# EAGLE design WIFI-RF433 (EAGLE 6.1)

## Sheet 1 of 3
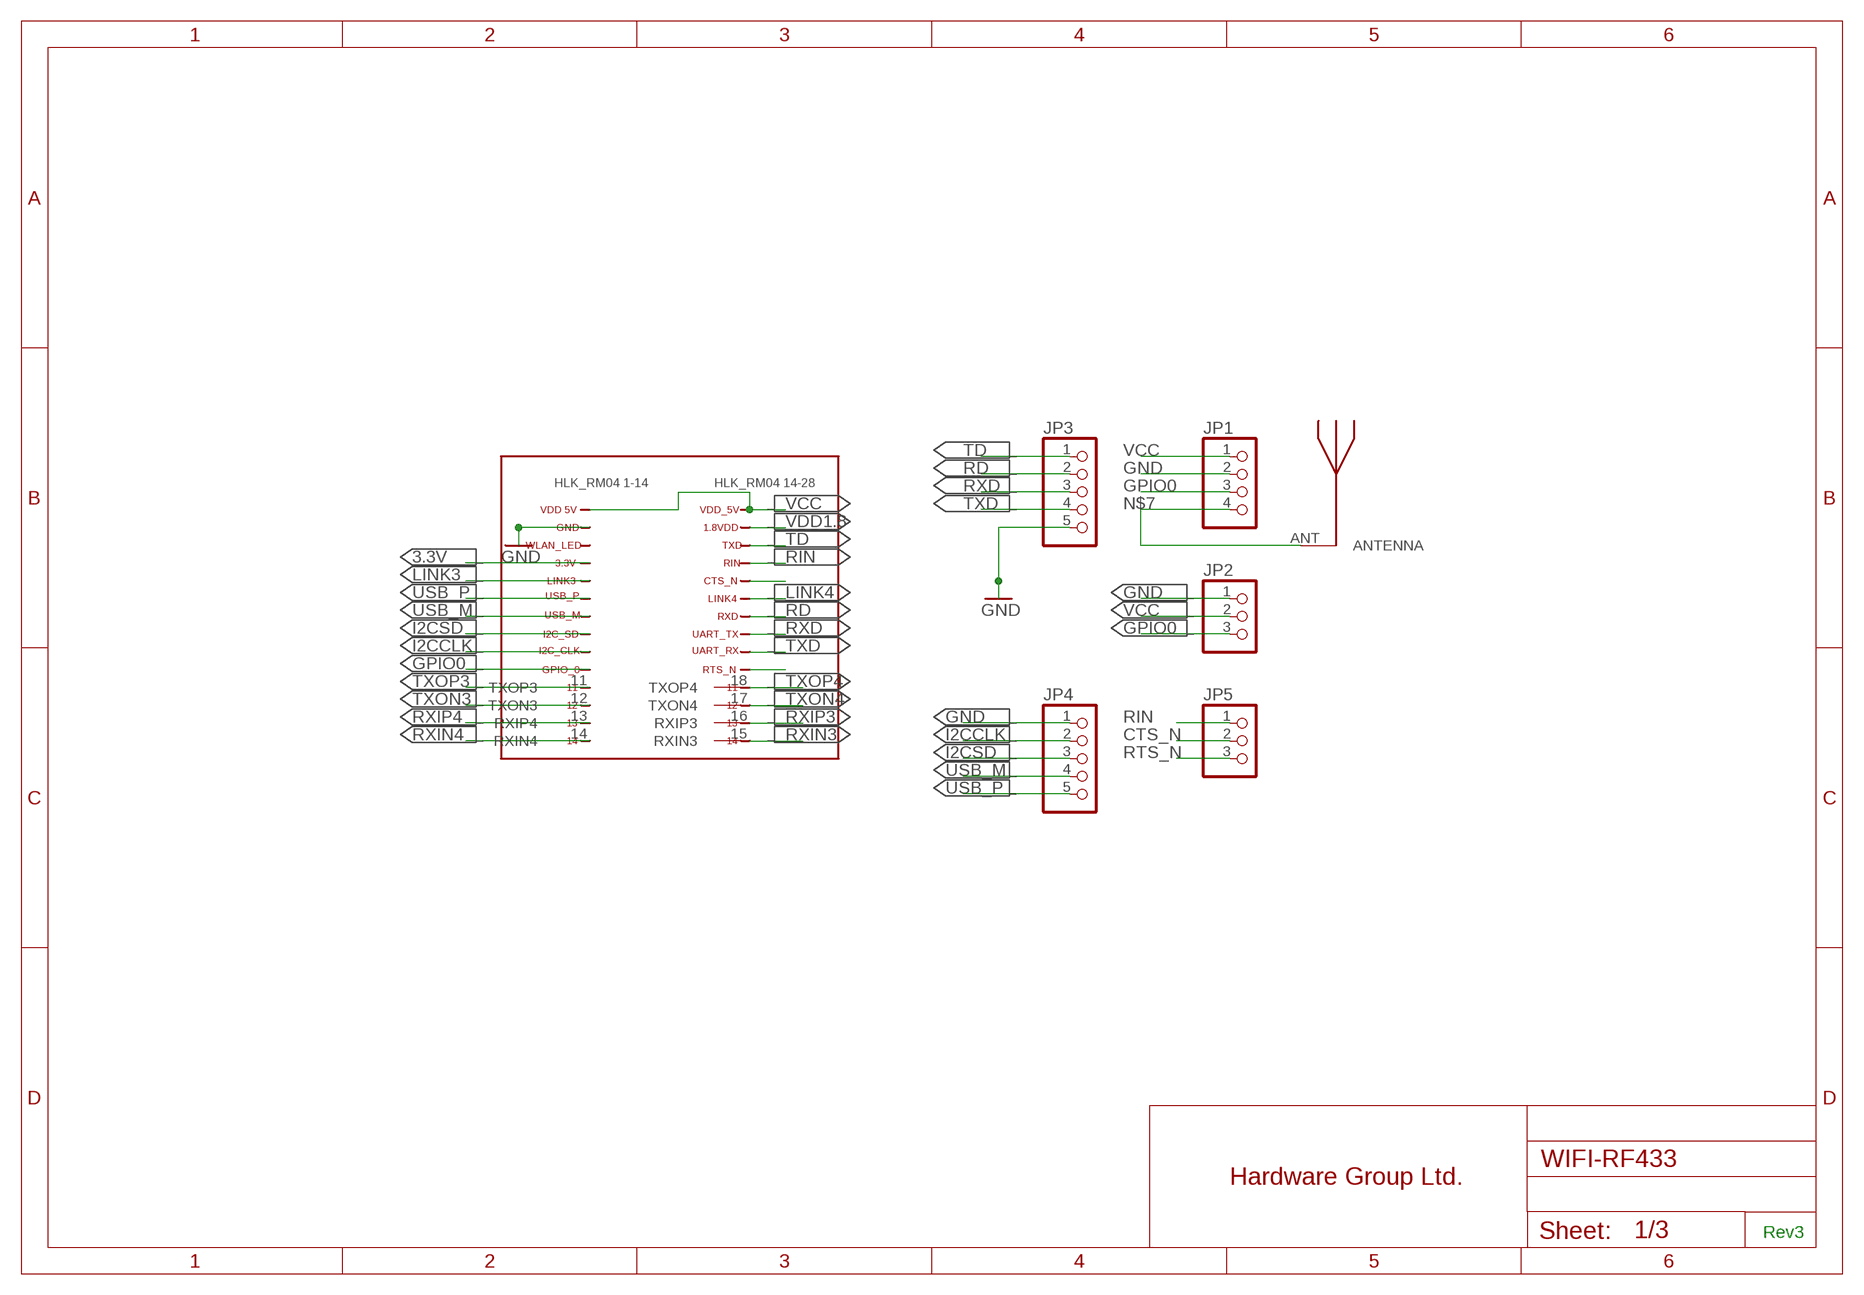
[diagram p0: schematic, sheet 1]

### Parts
JP1  PINHD-1X4  [1X04]
JP2  PINHD-1X3  [1X03]
JP3  PINHD-1X5  [1X05]
JP4  PINHD-1X5  [1X05]
JP5  PINHD-1X3  [1X03]
U$4  433MHZ  [433MHZ]
U$8  1X10  [1X10]

### Nets
3.3V: U$8.4(3.3VDD)
CTS_N: JP5.2 U$8.24(CTS_N)
GND: JP1.2 JP2.1 JP3.5 JP4.1 U$8.2(GND) ; also sheet 2,3
GPIO0: JP1.3 JP2.3 U$8.10(GPIO_0)
I2CCLK: JP4.2 U$8.9(I2C_CLK)
I2CSD: JP4.3 U$8.8(I2C_SD)
LINK3: U$8.5(LINK3) ; also sheet 2
LINK4: U$8.23(LINK4) ; also sheet 2
N$7: JP1.4 U$4.ANT(ANTENNA)
RD: JP3.2 U$8.22(RXD)
RIN: JP5.1 U$8.25(RIN)
RTS_N: JP5.3 U$8.19(RTS_N)
RXD: JP3.3 U$8.21(UART_TX)
RXIN3: U$8.15(RXIN3) ; also sheet 2
RXIN4: U$8.14(RXIN4) ; also sheet 2
RXIP3: U$8.16(RXIP3) ; also sheet 2
RXIP4: U$8.13(RXIP4) ; also sheet 2
TD: JP3.1 U$8.26(TXD)
TXD: JP3.4 U$8.20(UART_RX)
TXON3: U$8.12(TXON3) ; also sheet 2
TXON4: U$8.17(TXON4) ; also sheet 2
TXOP3: U$8.11(TXOP3) ; also sheet 2
TXOP4: U$8.18(TXOP4) ; also sheet 2
USB_M: JP4.4 U$8.7(USB_M)
USB_P: JP4.5 U$8.6(USB_P)
VCC: JP1.1 JP2.2 U$8.1(VDD_5V) U$8.28(VDD_5V_) ; also sheet 3
VDD1.8: U$8.27(1.8VDD) ; also sheet 2
Unconnected: U$8.3(WLAN_LED)

### Notes on the sheet
- Hardware Group Ltd.
- Rev3
- C:/Users/DellUser/Desktop/coil1.bmp

## Sheet 2 of 3
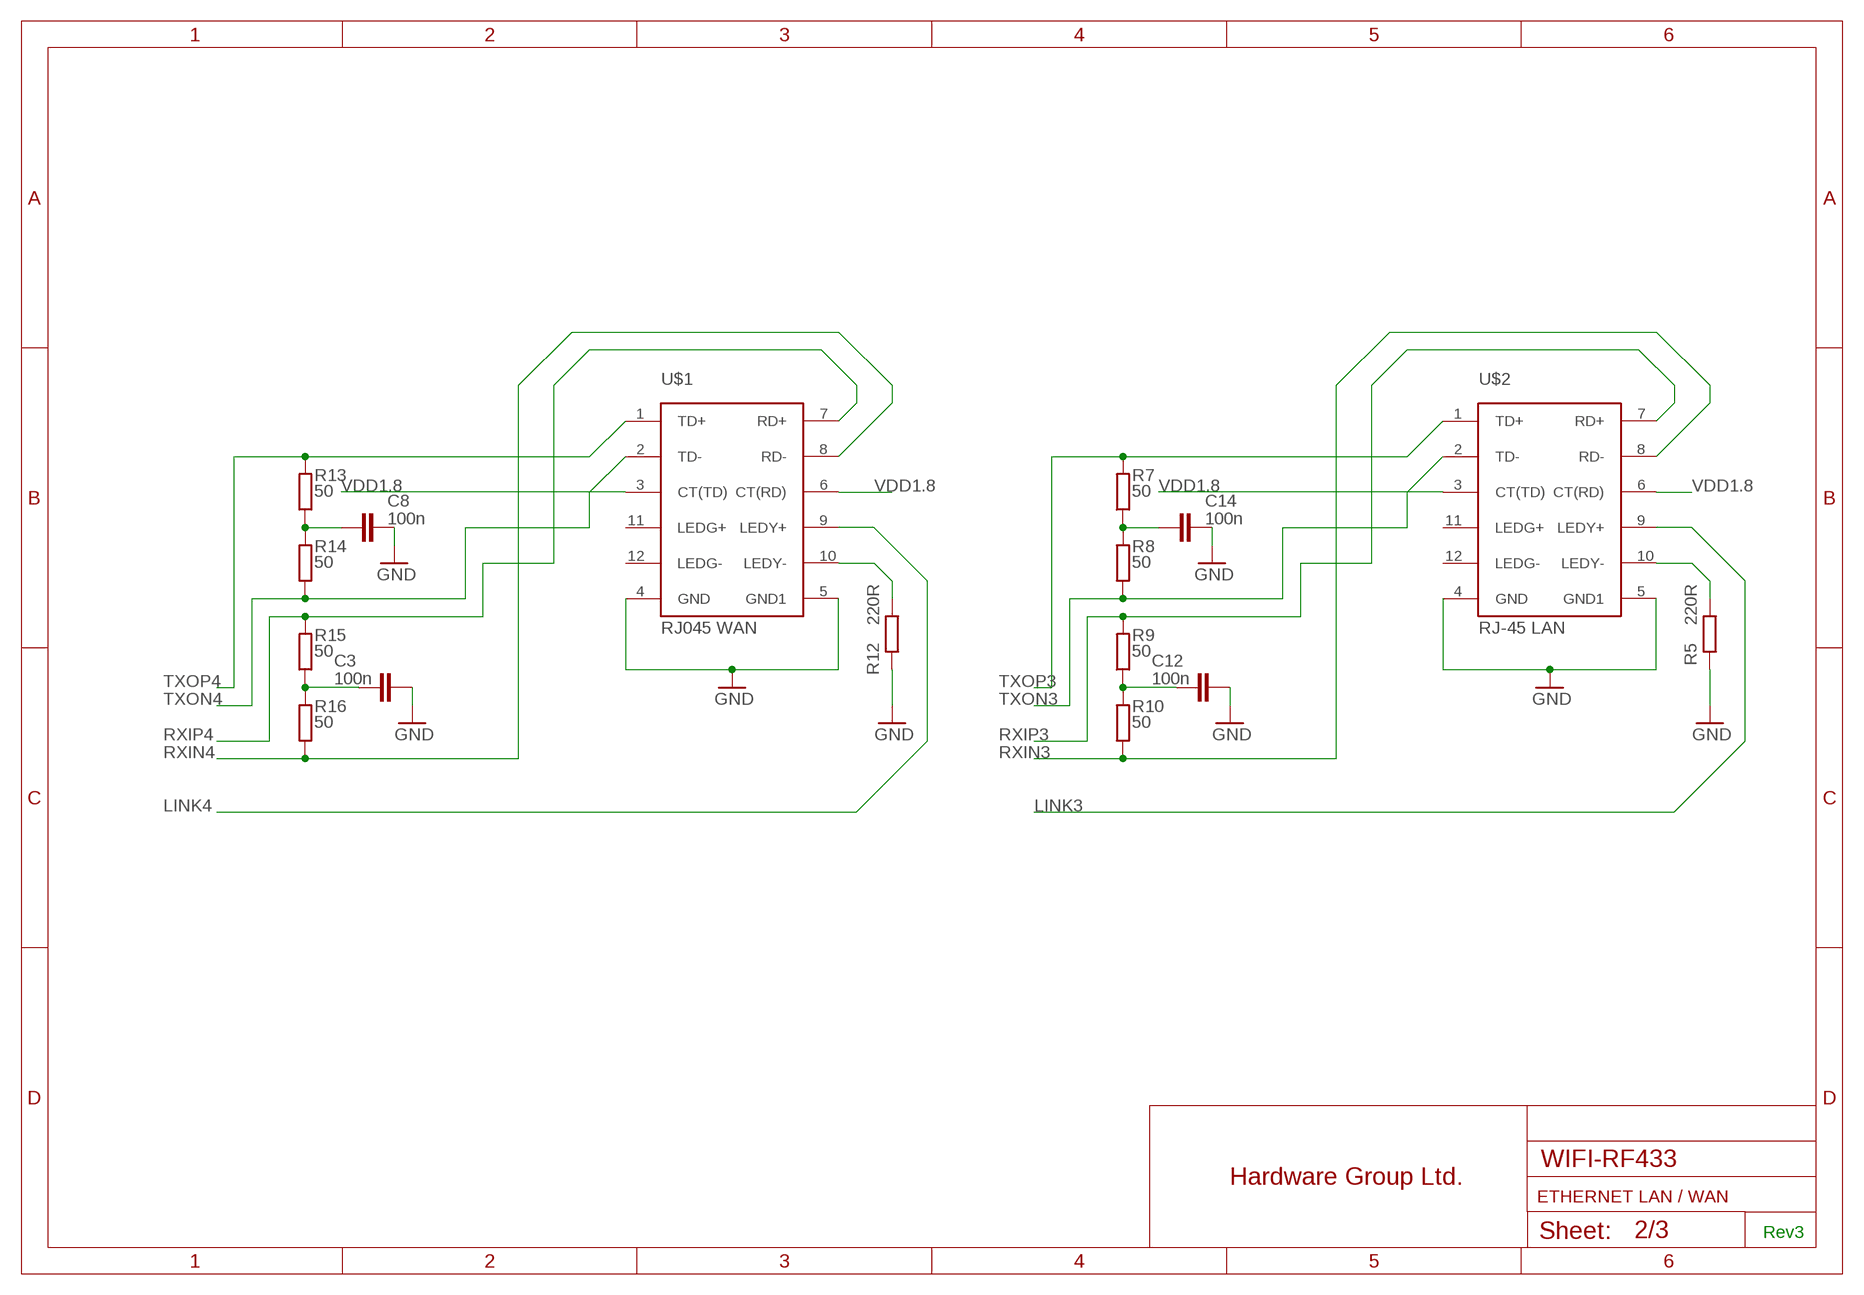
[diagram p1: schematic, sheet 2]

### Parts
C3  100n  C-EUC0805  [C0805]
C8  100n  C-EUC0805  [C0805]
C12  100n  C-EUC0805  [C0805]
C14  100n  C-EUC0805  [C0805]
R5  220R  R-EU_R0805  [R0805]
R7  50  R-EU_R0805  [R0805]
R8  50  R-EU_R0805  [R0805]
R9  50  R-EU_R0805  [R0805]
R10  50  R-EU_R0805  [R0805]
R12  220R  R-EU_R0805  [R0805]
R13  50  R-EU_R0805  [R0805]
R14  50  R-EU_R0805  [R0805]
R15  50  R-EU_R0805  [R0805]
R16  50  R-EU_R0805  [R0805]
U$1  RJ045 WAN  MAGJACKRJ45  [MAGJACK]
U$2  RJ-45 LAN  MAGJACKRJ45  [MAGJACK]

### Nets
GND: C3.2 C8.2 C12.2 C14.2 R5.1 R12.1 U$1.4(GND) U$1.5(GND1) U$2.4(GND) U$2.5(GND1) ; also sheet 1,3
LINK3: U$2.9(LEDY+) ; also sheet 1
LINK4: U$1.9(LEDY+) ; also sheet 1
N$6: R5.2 U$2.10(LEDY-)
N$24: C3.1 R15.1 R16.2
N$26: R12.2 U$1.10(LEDY-)
N$31: C8.1 R13.1 R14.2
N$32: C14.1 R7.1 R8.2
N$41: C12.1 R9.1 R10.2
RXIN3: R10.1 U$2.8(RD-) ; also sheet 1
RXIN4: R16.1 U$1.8(RD-) ; also sheet 1
RXIP3: R9.2 U$2.7(RD+) ; also sheet 1
RXIP4: R15.2 U$1.7(RD+) ; also sheet 1
TXON3: R8.1 U$2.2(TD-) ; also sheet 1
TXON4: R14.1 U$1.2(TD-) ; also sheet 1
TXOP3: R7.2 U$2.1(TD+) ; also sheet 1
TXOP4: R13.2 U$1.1(TD+) ; also sheet 1
VDD1.8: U$1.3(CT(TD)) U$1.6(CT(RD)) U$2.3(CT(TD)) U$2.6(CT(RD)) ; also sheet 1
Unconnected: U$1.11(LEDG+) U$1.12(LEDG-) U$2.11(LEDG+) U$2.12(LEDG-)

### Notes on the sheet
- Hardware Group Ltd.
- ETHERNET LAN / WAN
- Rev3

## Sheet 3 of 3
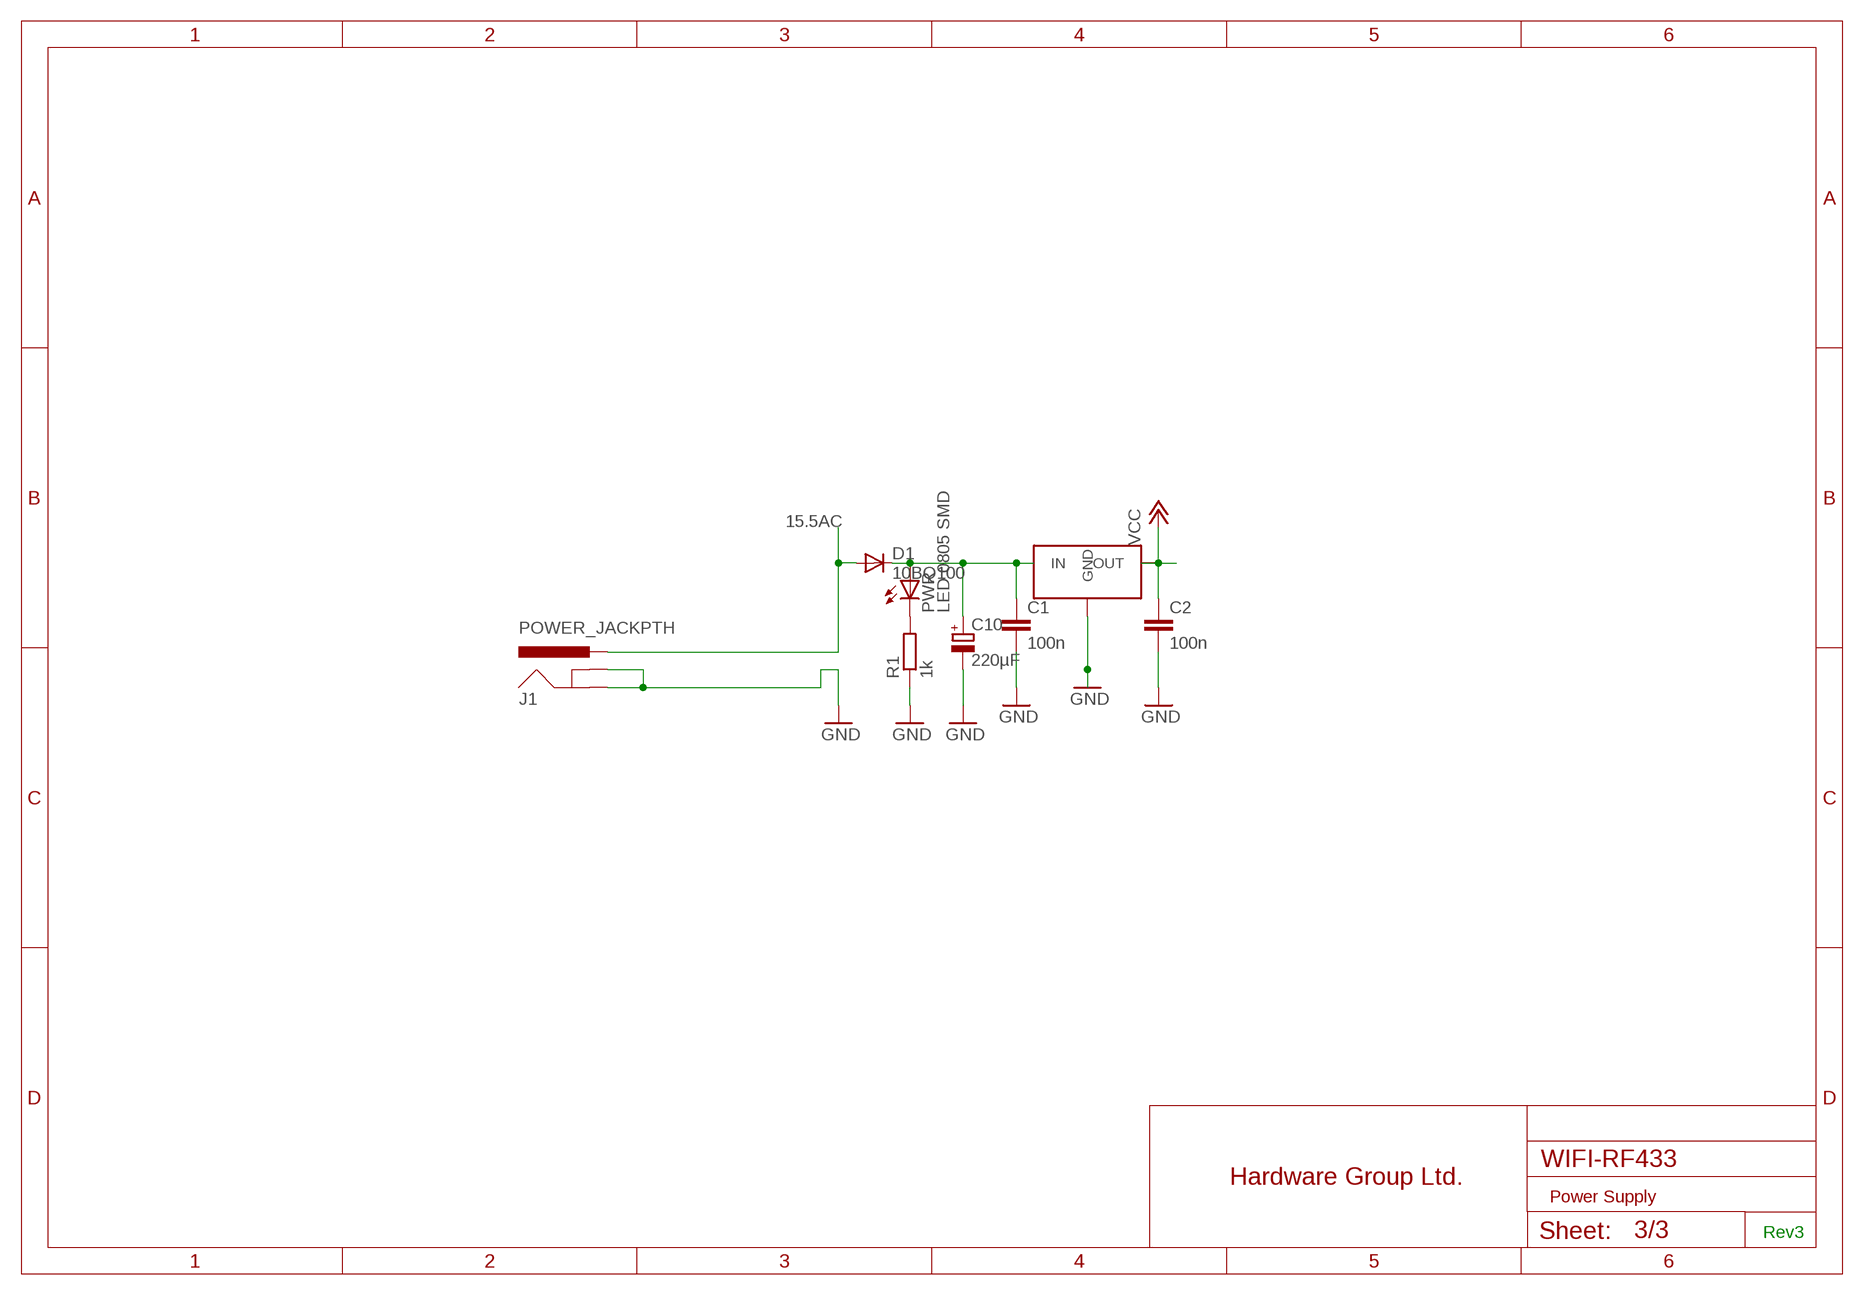
[diagram p2: schematic, sheet 3]

### Parts
C1  100n  C-EUC0805  [C0805]
C2  100n  C-EUC0805  [C0805]
C10  220µF  CPOL-EUE3.5-8  [E3,5-8]
D1  10BQ100  DIODE-SMB  [SMB]
J1  POWER_JACKPTH  [POWER_JACK_PTH]
PWR  LED 0805 SMD  LEDCHIP-LED0805  [CHIP-LED0805]
R1  1k  R-EU_M0805  [M0805]
U$3  VREG-7805-DPAK2  [VREG-7805-DPAK2]

### Nets
15.5AC: D1.A J1.PWR
GND: C1.2 C2.2 C10.- J1.GND J1.GNDBREAK R1.1 U$3.GND ; also sheet 1,2
N$1: PWR.C R1.2
N$3: C1.1 C10.+ D1.C PWR.A U$3.VIN(IN)
VCC: C2.1 U$3.VOUT(OUT) ; also sheet 1

### Notes on the sheet
- Hardware Group Ltd.
- Power Supply
- Rev3

## Library data of the parts
C1-C3 C8 C12 C14 = rcl:C-EU: CAPACITOR, European symbol
C10 = rcl:CPOL-EU: POLARIZED CAPACITOR, European symbol
D1 = diode:DIODE-: DIODE
J1 = SparkFun-Connectors:POWER_JACK: Power Jack This is the standard 5.5mm barrel jack for power. The PTH is the most common, proven, reliable, footprint. The Slot footprint only works if the mill layer is transmitted to the PCB fab house so be warned. Mating wall wart : TOL-00298 (and others); PROD_ID: CONN-08197
JP1 = pinhead:PINHD-1X4: PIN HEADER
JP2 JP5 = pinhead:PINHD-1X3: PIN HEADER
JP3 JP4 = pinhead:PINHD-1X5: PIN HEADER
PWR = led:LED: LED OSRAM: - CHIPLED LG R971, LG N971, LY N971, LG Q971, LY Q971, LO R971, LY R971 LH N974, LH R974 LS Q976, LO Q976, LY Q976 LO Q996 - Hyper CHIPLED LW Q18S LB Q993, LB Q99A, LB R99A - SideLED LS A670, LO A670, LY A670, LG A670, LP A670 LB A673, LV A673, LT A673, LW A673 LH A674 LY A675 LS A676, LA A676, LO A676, LY A676, LW A676 LS A679, LY A679, LG A679 - Hyper Micro SIDELED® LS Y876, LA Y876, LO Y876, LY Y876 LT Y87S - SmartLED LW L88C, LW L88S LB L89C, LB L89S, LG L890 LS L89K, LO L89K, LY L89K LS L896, LA L896, LO L896, LY L896 - TOPLED LS T670, LO T670, LY T670, LG T670, LP T670 LSG T670, LSP T670, LSY T670, LOP T670, LYG T670 LG T671, LOG T671, LSG T671 LB T673, LV T673, LT T673, LW T673 LH T674 LS T676, LA T676, LO T676, LY T676, LB T676, LH T676, LSB T676, LW T676 LB T67C, LV T67C, LT T67C, LS T67K, LO T67K, LY T67K, LW E67C LS E67B, LA E67B, LO E67B, LY E67B, LB E67C, LV E67C, LT E67C LW T67C LS T679, LY T679, LG T679 LS T770, LO T770, LY T770, LG T770, LP T770 LB T773, LV T773, LT T773, LW T773 LH T774 LS E675, LA E675, LY E675, LS T675 LS T776, LA T776, LO T776, LY T776, LB T776 LHGB T686 LT T68C, LB T68C - Hyper Mini TOPLED® LB M676 - Mini TOPLED Santana® LG M470 LS M47K, LO M47K, LY M47K Source: http://www.osram.convergy.de LUXEON: - LUMILED® LXK2-PW12-R00, LXK2-PW12-S00, LXK2-PW14-U00, LXK2-PW14-V00 LXK2-PM12-R00, LXK2-PM12-S00, LXK2-PM14-U00 LXK2-PE12-Q00, LXK2-PE12-R00, LXK2-PE12-S00, LXK2-PE14-T00, LXK2-PE14-U00 LXK2-PB12-K00, LXK2-PB12-L00, LXK2-PB12-M00, LXK2-PB14-N00, LXK2-PB14-P00, LXK2-PB14-Q00 LXK2-PR12-L00, LXK2-PR12-M00, LXK2-PR14-Q00, LXK2-PR14-R00 LXK2-PD12-Q00, LXK2-PD12-R00, LXK2-PD12-S00 LXK2-PH12-R00, LXK2-PH12-S00 LXK2-PL12-P00, LXK2-PL12-Q00, LXK2-PL12-R00 Source: www.luxeon.com KINGBRIGHT: KA-3528ASYC Source: www.kingbright.com
R1 R5 R7-R10 R12-R16 = rcl:R-EU_: RESISTOR, European symbol
U$1 U$2 = morethanall_magjack:MAGJACK: MORETHANALL MagJack RJ45 with built-in magnetics. Part no. MJF13T3L-KF06B3YG-0808
U$3 = vreg-7805-dpak2:VREG-7805-DPAK2
U$4 = 433mhz:433MHZ: 433MHZ PCB Antenna
U$8 = joro2mm):1X10

## Board
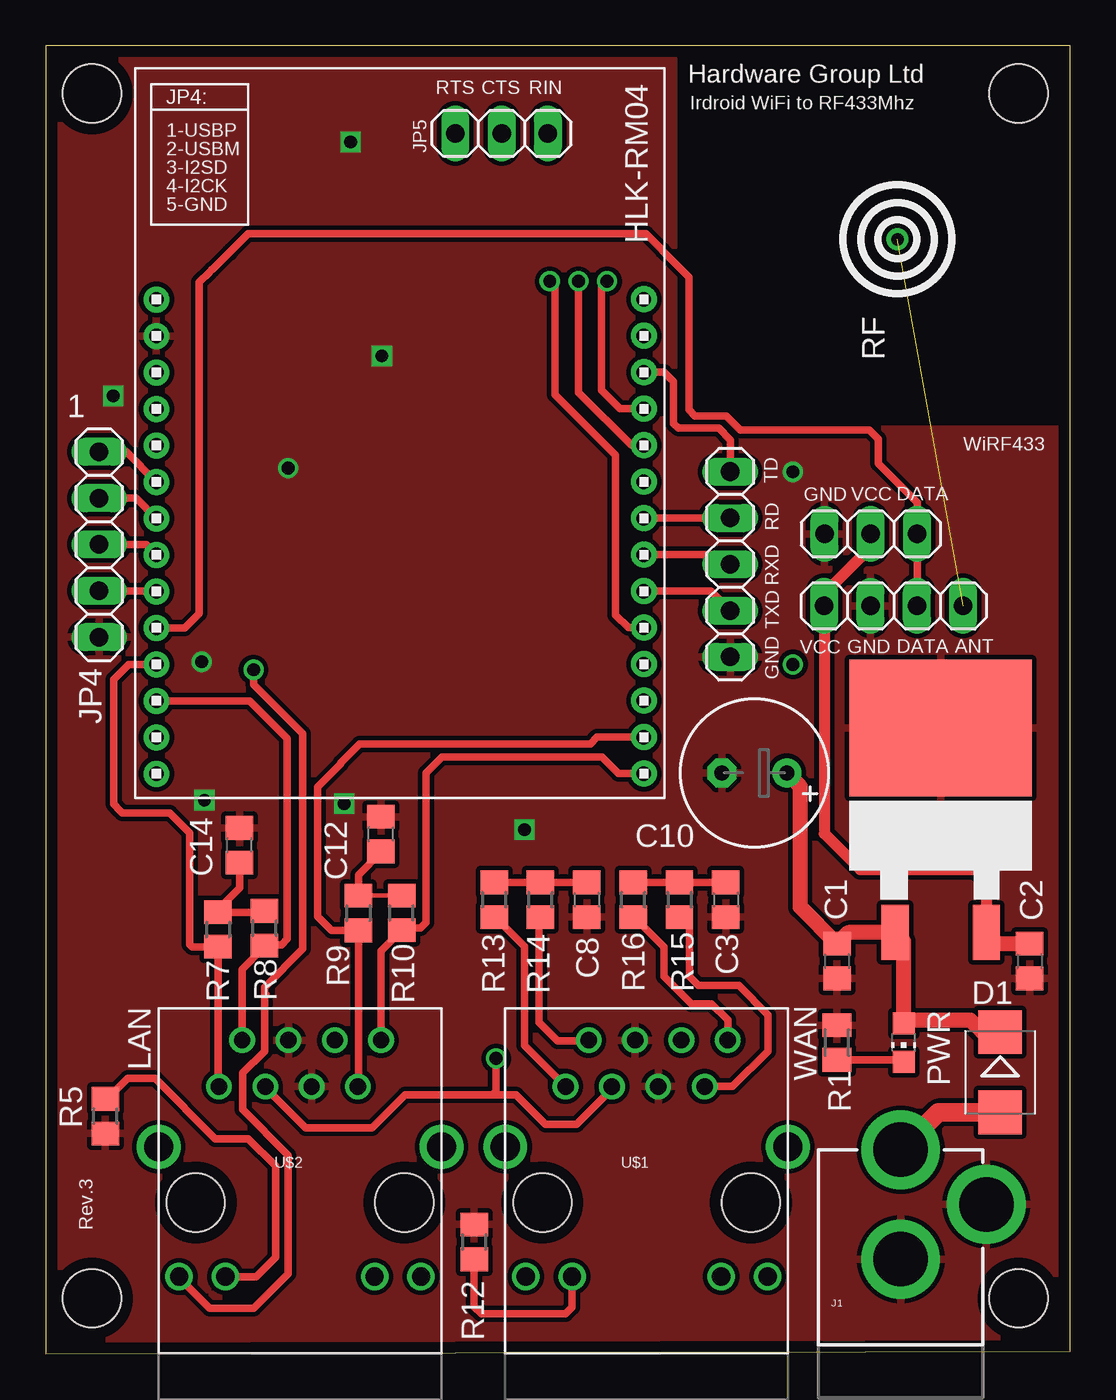
[diagram p3: board, top side]
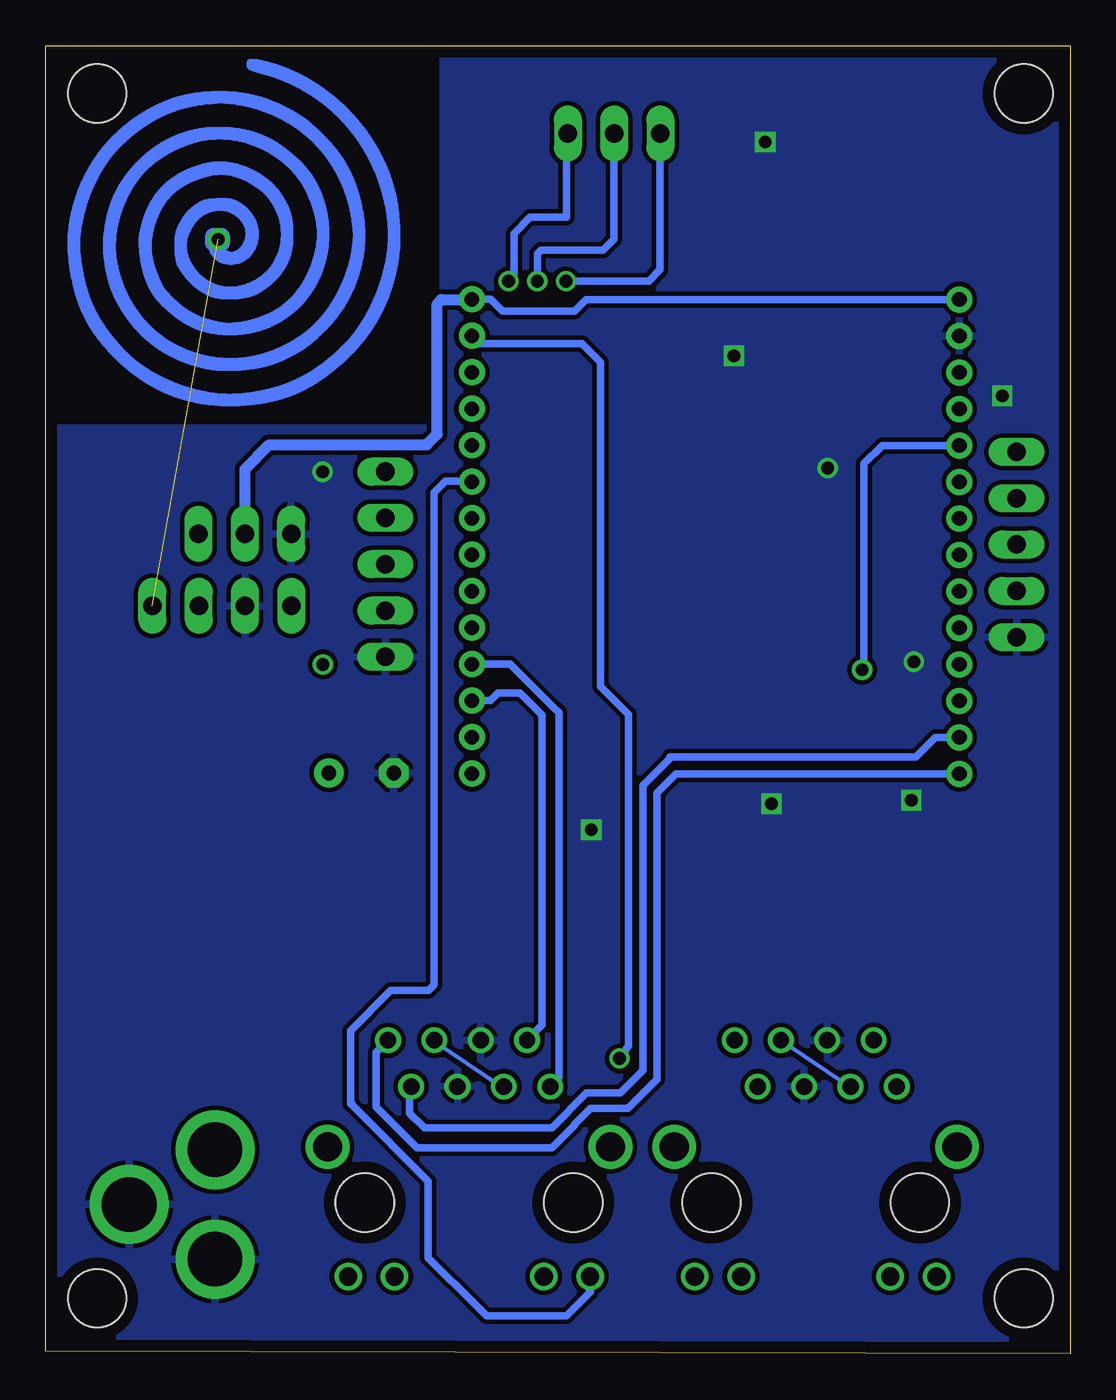
[diagram p4: board, bottom side, seen from below]

Size 56.16 x 71.71 mm. Coordinates in mm from the lower left corner, seen from the top.
Outline: 56.16,0.15 56.16,71.71 0,71.71 0,0 56.16,0.15
Copper layers (1*16): Top 0.035mm / dielectric 1.5mm / Bottom 0.035mm
Design rules: minimum track width 10mil, minimum drill 24mil, track to track 10mil, track to pad 10mil, pad to pad 10mil, via to via 8mil, smd to smd 8mil, copper to edge 25mil, drill to drill 8mil, minimum pad ring 10mil, minimum via ring 8mil, stop-mask expansion 4mil, vias tented up to drill 0mil, thermal gap 10mil
Holes 3.2 mm at 2.54,3.04 53.34,3.04 53.34,69.08 2.54,69.08

### Footprints (pad centres in the part's own frame; a part is rotated, then mirrored left to right if it is on the bottom)
C0805 = smd 1.3 x 1.5: 1 -0.95,0; 2 0.95,0
E3,5-8 = drill 0.813 pad 1.6: + -1.778,0 | drill 0.813 pad 1.6 octagon: - 1.778,0
SMB = smd 2.4 x 2.4: A 2.2,0; C -2.2,0
POWER_JACK_PTH = drill 2.997 pad 4.318: GND 0,7.7; GNDBREAK 4.7,10.7; PWR 0,13.7
1X04 = drill 1.016 long: 1 -3.81,0; 2 -1.27,0; 3 1.27,0; 4 3.81,0
1X03 = drill 1.016 long: 1 -2.54,0; 2 0,0; 3 2.54,0
1X05 = drill 1.016 long: 1 -5.08,0; 2 -2.54,0; 3 0,0; 4 2.54,0; 5 5.08,0
CHIP-LED0805 = smd 1.2 x 1.2: A 0,-1.05; C 0,1.05
M0805 = smd 1.3 x 1.6: 1 -0.95,0; 2 0.95,0
R0805 = smd 1.3 x 1.5: 1 -0.95,0; 2 0.95,0
MAGJACK = drill 0.9: 1 3.305,17.16; 2 4.575,19.7; 3 5.845,17.16; 4 7.115,19.7; 5 8.385,17.16; 6 9.655,19.7; 7 10.925,17.16; 8 12.195,19.7 | drill 1: 9 1.12,6.74; 10 3.66,6.74; 11 11.84,6.74; 12 14.38,6.74 | drill 1.6: S1 0,13.85; S2 15.5,13.85 | hole 3.2: 13.465,10.8; 2.035,10.8
VREG-7805-DPAK2 = smd 10 x 7.5: GND 0,8.7 | smd 1.5 x 3: VIN -2.5,-2.5; VOUT 2.5,-2.5
433MHZ = drill 0.7: ANT 0.005,-0.005
1X10 = drill 0.8 pad 1.422: 1 1.16,27.32; 2 1.16,25.32; 3 1.16,23.32; 4 1.16,21.32; 5 1.16,19.32; 6 1.16,17.32; 7 1.16,15.32; 8 1.16,13.32; 9 1.16,11.32; 10 1.16,9.32; 11 1.16,7.32; 12 1.16,5.32; 13 1.16,3.32; 14 1.16,1.32; 15 27.88,1.33; 16 27.88,3.33; 17 27.88,5.33; 18 27.88,7.33; 19 27.88,9.33; 20 27.88,11.33; 21 27.88,13.33; 22 27.88,15.33; 23 27.88,17.33; 24 27.88,19.33; 25 27.88,21.33; 26 27.88,23.33; 27 27.88,25.33; 28 27.88,27.33

### Placement (x,y rotation side)
C1  43.38,21.53 270 top
C2  53.95,21.53 270 top
C3  37.28,24.89 270 top
C8  29.66,24.89 270 top
C10  38.85,31.85 180 top
C12  18.38,28.49 90 top
C14  10.62,27.87 90 top
D1  52.32,15.44 270 top
J1  46.87,-2.51 0 top
JP1  46.49,41 0 top
JP2  45.23,44.95 0 top
JP3  37.53,43.28 270 top
JP4  2.93,44.36 90 top
JP5  25,66.9 180 top
PWR  47.04,17.06 180 top
R1  43.38,17.06 270 top
R5  3.28,13.03 90 top
R7  9.45,23.26 270 top
R8  12,23.32 90 top
R9  17.15,24.16 270 top
R10  19.52,24.17 90 top
R12  23.49,6.14 270 top
R13  24.58,24.89 270 top
R14  27.12,24.89 90 top
R15  34.74,24.89 270 top
R16  32.2,24.89 90 top
U$1  25.2,-2.5 0 top
U$2  6.2,-2.5 0 top
U$3  49.07,25.6 0 top
U$4  46.7,61.09 0 top
U$8  4.92,30.48 0 top

### Tracks (layer width: path | path; a pad name or v marks a point on that pad's centre or on a via)
15.5AC
  Top 0.254: 46.9,11.2 46.89,11.21 J1.PWR
  Top 1.016: D1.A 48.94,13.24 46.9,11.2 46.9,11.19
CTS_N  (via drill 0.7)
  Top 0.406: U$8.24 32.1,49.8 29.21,52.7 v29.21,58.8
  Bottom 0.254: 29.2,58.81 v29.21,58.8 29.2,59.02 | 29.2,59.02
  Bottom 0.406: 25.02,66.88 JP5.2 25,61.09 25.6,60.49 29,60.49 29.2,60.29 29.2,59.02 v29.2,58.79 | 29.2,58.81 v29.2,58.79 | v29.2,58.79
GND  (via drill 0.7)
  other vias: 13.29,48.55 26.25,28.73 16.37,30.16 3.71,52.51 8.7,30.35 16.71,66.42 18.43,54.7 40.97,48.35 8.56,37.94
  pour Bottom: 0.1,71.62 34.38,71.62 34.38,50.74 56.18,50.74 56.18,0.23 0.14,0.23 0.14,71.61
  pour Top: 34.42,71.55 34.42,50.7 56.1,50.7 56.1,0.32 0.19,0.32 0.19,71.55
GPIO0
  Top 0.254: U$8.10 6.11,39.77 | 8.99,59.29 9.04,59.25 9.13,59.44 | JP1.3 | 10.05,60.36 10.12,60.29 10.2,60.49
  Top 0.406: 9.12,59.42 8.99,59.29 8.43,58.73 8.43,40.57 7.63,39.77 6.11,39.77 6.04,39.85 | 10.17,60.48 10.05,60.36 9.13,59.44 | JP1.3 JP2.3 47.77,46.66 45.64,48.79 45.64,50.14 45.16,50.63 38.09,50.63 37.31,51.4 35.61,51.4 35.25,51.76 35.25,59.03 33.81,60.48 33.81,60.49 32.9,61.39 11.1,61.39 10.2,60.49
I2CCLK
  Top 0.406: JP4.2 6.05,41.82 U$8.9
I2CSD
  Top 0.406: JP4.3 5.51,44.36 U$8.8
LINK3  (via drill 0.7)
  Top 0.254: U$2.9 7.32,4.25 7.3,4.2 | 10.8,15.11 10.79,15.31 | 13.17,4.26 13.22,4.21 13.3,4.41 | 12.18,19.73 12,19.73
  Top 0.406: 10.8,15.29 10.8,15.11 10.8,13.39 13.3,10.89 13.3,4.41 | 7.3,4.2 7.3,4.19 9,2.5 11.4,2.5 13.17,4.26 13.3,4.4 | 10.79,15.31 10.79,15.39 12,16.6 12,19.73 12,20.1 14.1,22.2 14.1,33.99 11.4,36.7 v11.4,37.49
  Bottom 0.254: v11.39,37.5 11.38,37.49 v11.4,37.49
  Bottom 0.406: U$8.5 10.3,49.79 11.3,48.79 11.3,37.59 v11.39,37.5 v11.4,37.49
LINK4
  Bottom 0.254: 26.35,4.2 26.36,4.19 26.33,4.19 26.32,4.25 U$1.9 26.34,3.6 26.3,3.4 | 39.31,13.59 39.36,13.54 39.45,13.72
  Bottom 0.406: 39.45,13.72 39.45,17.71 37.24,19.92 35.17,19.92 34.88,20.21 34.88,47.2 34.24,47.84 32.83,47.84 U$8.23 | 26.33,3.35 26.33,4.19 26.33,4.27 26.4,4.34 | 39.36,13.71 39.43,13.71 39.31,13.59 35.19,9.47 35.19,5.26 32.52,2.6 32.5,2.6 32,2.1 27.6,2.1 26.3,3.4
N$1
  Top 0.254: PWR.C 47.03,16.03 46.92,16.11
  Top 0.406: R1.2 46.92,16.11 47.14,15.89
N$2  (via drill 0.7)
  other vias: 40.97,37.79
N$3
  Top 0.254: C10.+ 40.65,31.86 40.64,31.85
  Top 0.813: D1.C 51.34,17.64 50.69,18.28 47.21,18.28 PWR.A 47.04,22.63 U$3.VIN 43.99,23.1 C1.1 41.37,24.49 41.37,31.11 40.64,31.85 C10.+
N$6
  Top 0.254: R5.2 3.38,13.97 3.4,13.99
  Top 0.406: U$2.10 11.54,4.24 12.6,5.29 12.6,10.29 11.1,11.79 9.3,11.79 6,15.09 4.5,15.09 3.4,13.99
N$7  (1 unrouted)
N$24
  Top 0.406: R16.2 R15.1 | R15.1 35.15,25.84 35.31,25.68 34.91,25.68 R15.1 | R15.1 C3.1
N$26
  Top 0.254: R12.2
  Top 0.406: U$1.10 28.86,2.56 28.5,2.2 23.9,2.2 23.5,2.6 R12.2 | R12.2
N$31
  Top 0.406: R13.1 R14.2 C8.1
N$32
  Top 0.254: R7.1 9.46,24.22 9.51,24.2
  Top 0.406: C14.1 10.62,25.54 9.43,24.35 9.43,24.27 9.51,24.2 11.93,24.2 R8.2
N$41
  Top 0.254: R10.2 19.49,25.12 17.27,25.12 R9.1 | C12.1 18.39,27.54 18.4,27.5
  Top 0.406: R9.1 17.14,26.25 18.4,27.5
RD
  Top 0.406: U$8.22 37.52,45.8 JP3.2
RIN  (via drill 0.7)
  Top 0.254: v30.78,58.8 v30.78,58.79 v30.79,58.78
  Top 0.406: U$8.25 31.5,51.8 30.48,52.83 30.48,58.47 v30.79,58.78 30.8,58.79
  Bottom 0.254: JP5.1 27.6,66.9 | v30.78,58.8 v30.78,58.79 v30.79,58.8
  Bottom 0.406: 27.6,67 27.6,66.9 27.6,62.29 29.6,62.29 30.48,61.41 30.48,59.11 v30.79,58.8 30.8,58.79
RTS_N  (via drill 0.7)
  Top 0.254: v27.64,58.8 v27.64,58.79 27.7,58.79
  Top 0.406: U$8.19 31.94,39.8 31.24,40.51 31.24,49.27 27.94,52.57 27.94,58.55 27.7,58.79
  Bottom 0.254: JP5.3 22.48,66.8
  Bottom 0.406: 22.48,66.88 JP5.3 | 22.48,66.8 22.48,59.42 23.1,58.79 27.6,58.79 | 27.6,58.79 | 27.6,58.79 v27.64,58.79 v27.64,58.8
RXD
  Top 0.406: U$8.21 37.01,43.8 JP3.3
RXIN3
  Top 0.254: R10.1 19.61,23.13 | U$2.8 18.42,17.22 18.38,17.22
  Top 0.406: 18.38,17.16 18.38,17.22 18.38,22.08 R10.1 | U$8.15 31.41,31.8 30.49,32.73 21.74,32.73 20.85,31.83 20.85,23.64 20.55,23.34 19.82,23.34 19.61,23.13
RXIN4
  Top 0.254: 32.35,23.96 32.2,23.96 R16.1 32.23,23.96
  Top 0.406: 32.28,23.87 R16.1 | 32.35,23.96 32.35,24.38 | U$1.8 37.39,18.3 36.5,19.2 35.4,19.2 33.9,20.7 33.9,22.3 32.23,23.96 32.2,24
  Bottom 0.254: U$1.8 37.42,17.22 37.43,17.16
  Bottom 0.406: U$8.14 21.6,31.8 22.65,30.74 22.65,15.05 24.24,13.46 26.28,13.46 27.17,12.58 27.17,12.53 28.4,11.29 35.79,11.29 38.05,13.55 38.05,16.54 37.43,17.16 37.44,17.16 37.8,16.8
RXIP3
  Top 0.254: R9.2 17.17,23.22 17.17,23.21 | U$2.7 17.13,14.67 17.14,14.67
  Top 0.406: 17.11,14.61 17.14,14.61 17.14,14.67 R9.2 | U$8.16 30.22,33.8 29.86,33.44 17.21,33.44 16.16,32.39 16.16,32.32 14.92,31.09 14.92,23.97 15.68,23.21 17.17,23.21 17.21,23.21
RXIP4
  Top 0.406: U$1.7 37.66,14.65 39.6,16.6 39.6,18.6 38,20.2 35.8,20.2 35.3,20.7 35.3,23.39 R15.2
  Bottom 0.254: U$1.7 36.13,14.67 36.1,14.59
  Bottom 0.406: U$8.13 7.39,33.79 8.47,32.71 21.86,32.71 | 21.86,32.71 21.93,32.71 | 21.86,32.71 23.41,31.17 23.41,15.54 24.65,14.29 26.5,14.29 28.4,12.39 35.4,12.39 36.2,13.19 36.2,14.58 U$1.7
TD
  Top 0.406: U$8.26 33.89,53.8 34.42,53.28 34.42,51 34.68,50.74 36.9,50.74 37.55,50.09 37.55,48.38 JP3.1
TXD
  Top 0.406: U$8.20 36.47,41.8 JP3.4
TXON3
  Top 0.254: 11.89,22.21 11.91,22.19 R8.1 | U$2.2 10.77,17.22 10.76,17.22
  Top 0.406: 10.76,17.16 10.76,17.22 10.76,21.09 11.89,22.21 12.15,22.47 | U$8.12 11.19,35.79 13.25,33.74 13.25,22.75 12.93,22.43 12.05,22.43 R8.1
TXON4
  Top 0.406: R14.1 27.05,23.87 27.05,18.17 28.07,17.16 29.73,17.16 U$1.2
  Bottom 0.406: U$8.17 31.78,35.8 31.35,36.23 30.15,36.23 28.94,35.03 28.94,18.02 U$1.2
TXOP3
  Top 0.254: 4.07,29.8 4.1,29.83 4.21,29.66 | U$2.1 9.51,14.67 9.47,14.63
  Top 0.406: 4.21,29.66 6.79,29.66 7.89,28.55 7.89,22.44 8.02,22.31 R7.2 | R7.2 | 4.2,29.66 4.07,29.8 3.72,30.14 3.72,36.95 4.56,37.79 U$8.11 6.1,37.79 | R7.2 9.45,14.64 9.47,14.63 9.5,14.59
TXOP4
  Top 0.254: R13.2 24.59,23.96 24.61,23.99
  Top 0.406: 24.8,23.73 R13.2 | 24.22,24.38 24.61,23.99 26.25,22.35 26.25,16.91 U$1.1
  Bottom 0.254: 28.56,14.64 28.55,14.6 | 28.56,14.64 28.54,14.61 28.43,14.67 | 28.56,14.64 28.54,14.63 | 28.43,14.67 28.33,14.85 | U$1.1 28.51,14.67 28.43,14.67
  Bottom 0.406: 28.55,14.6 28.54,14.6 | U$8.18 30.69,37.8 28.3,35.41 28.03,35.15 28.03,15.16 28.33,14.85 | 28.3,14.87 28.54,14.63 28.55,14.62
USB_M
  Top 0.406: JP4.4 4.97,46.9 U$8.7
USB_P
  Top 0.406: JP4.5 4.43,49.44 U$8.6
VCC
  Top 0.254: 45.23,44.92 45.24,44.92 JP2.2
  Top 0.61: U$3.VOUT 51.58,23.11 51.58,25.94 50.96,26.55 44.66,26.55 42.68,28.52 JP1.1 42.68,41.68 45.23,44.23 45.23,44.92 45.23,44.99
  Top 0.813: C2.1 52.18,22.48 U$3.VOUT
  Bottom 0.254: U$8.28 32.82,57.83 32.84,57.79 | U$8.1 6.1,57.8 6.1,57.78
  Bottom 0.406: U$8.1 | U$8.28 31.77,57.8 31.11,57.14 27.17,57.14 26.54,57.78 6.1,57.78 6.09,57.78
  Bottom 0.61: 32.84,57.79 34.45,57.79 34.7,57.54 34.7,50.4 35.27,49.83 43.9,49.83 45.23,48.49 JP2.2
VDD1.8  (via drill 0.7)
  Top 0.254: U$2.3 12.06,14.67 12.03,14.61
  Top 0.406: 12.03,14.61 14.25,12.39 17.9,12.39 19.7,14.19 24.5,14.19 | v24.7,16.2 | U$1.3 31.04,14.54 29.1,12.59 27.4,12.59 26.8,13.19 | 26.8,13.19 25.8,14.19 24.5,14.19 | v24.7,16.2 24.7,14.39 24.5,14.19 | 26.8,13.19
  Bottom 0.254: U$8.27 32.81,55.83 | U$1.6 34.87,17.22 34.89,17.16 31.24,14.69 | 31.24,14.69 31.1,14.59 | U$2.6 12.07,14.64 | 12.07,14.64 12,14.59 | 31.24,14.69 31.18,14.79 U$1.3 | U$2.3 12.06,14.65 12.07,14.64
  Bottom 0.406: 32.85,55.88 32.81,55.83 32.35,55.37 26.76,55.37 25.74,54.35 25.74,36.57 24.22,35.05 24.22,16.87 v24.7,16.2 | 31.08,14.61 31.08,14.62 U$1.3

### Text on the board
tNames: Hardware Group Ltd | RTS | CTS | RIN | JP4: | Irdroid WiFi to RF433Mhz | 1-USBP | 2-USBM | 3-I2SD | 4-I2CK | 5-GND | RF | 1 | WiRF433 | TD | GND | VCC | DATA | RD | RXD | TXD | VCC | GND | DATA | ANT | GND | LAN | WAN | Rev.3